# EAGLE design terminator-sil (EAGLE 6.6.0)
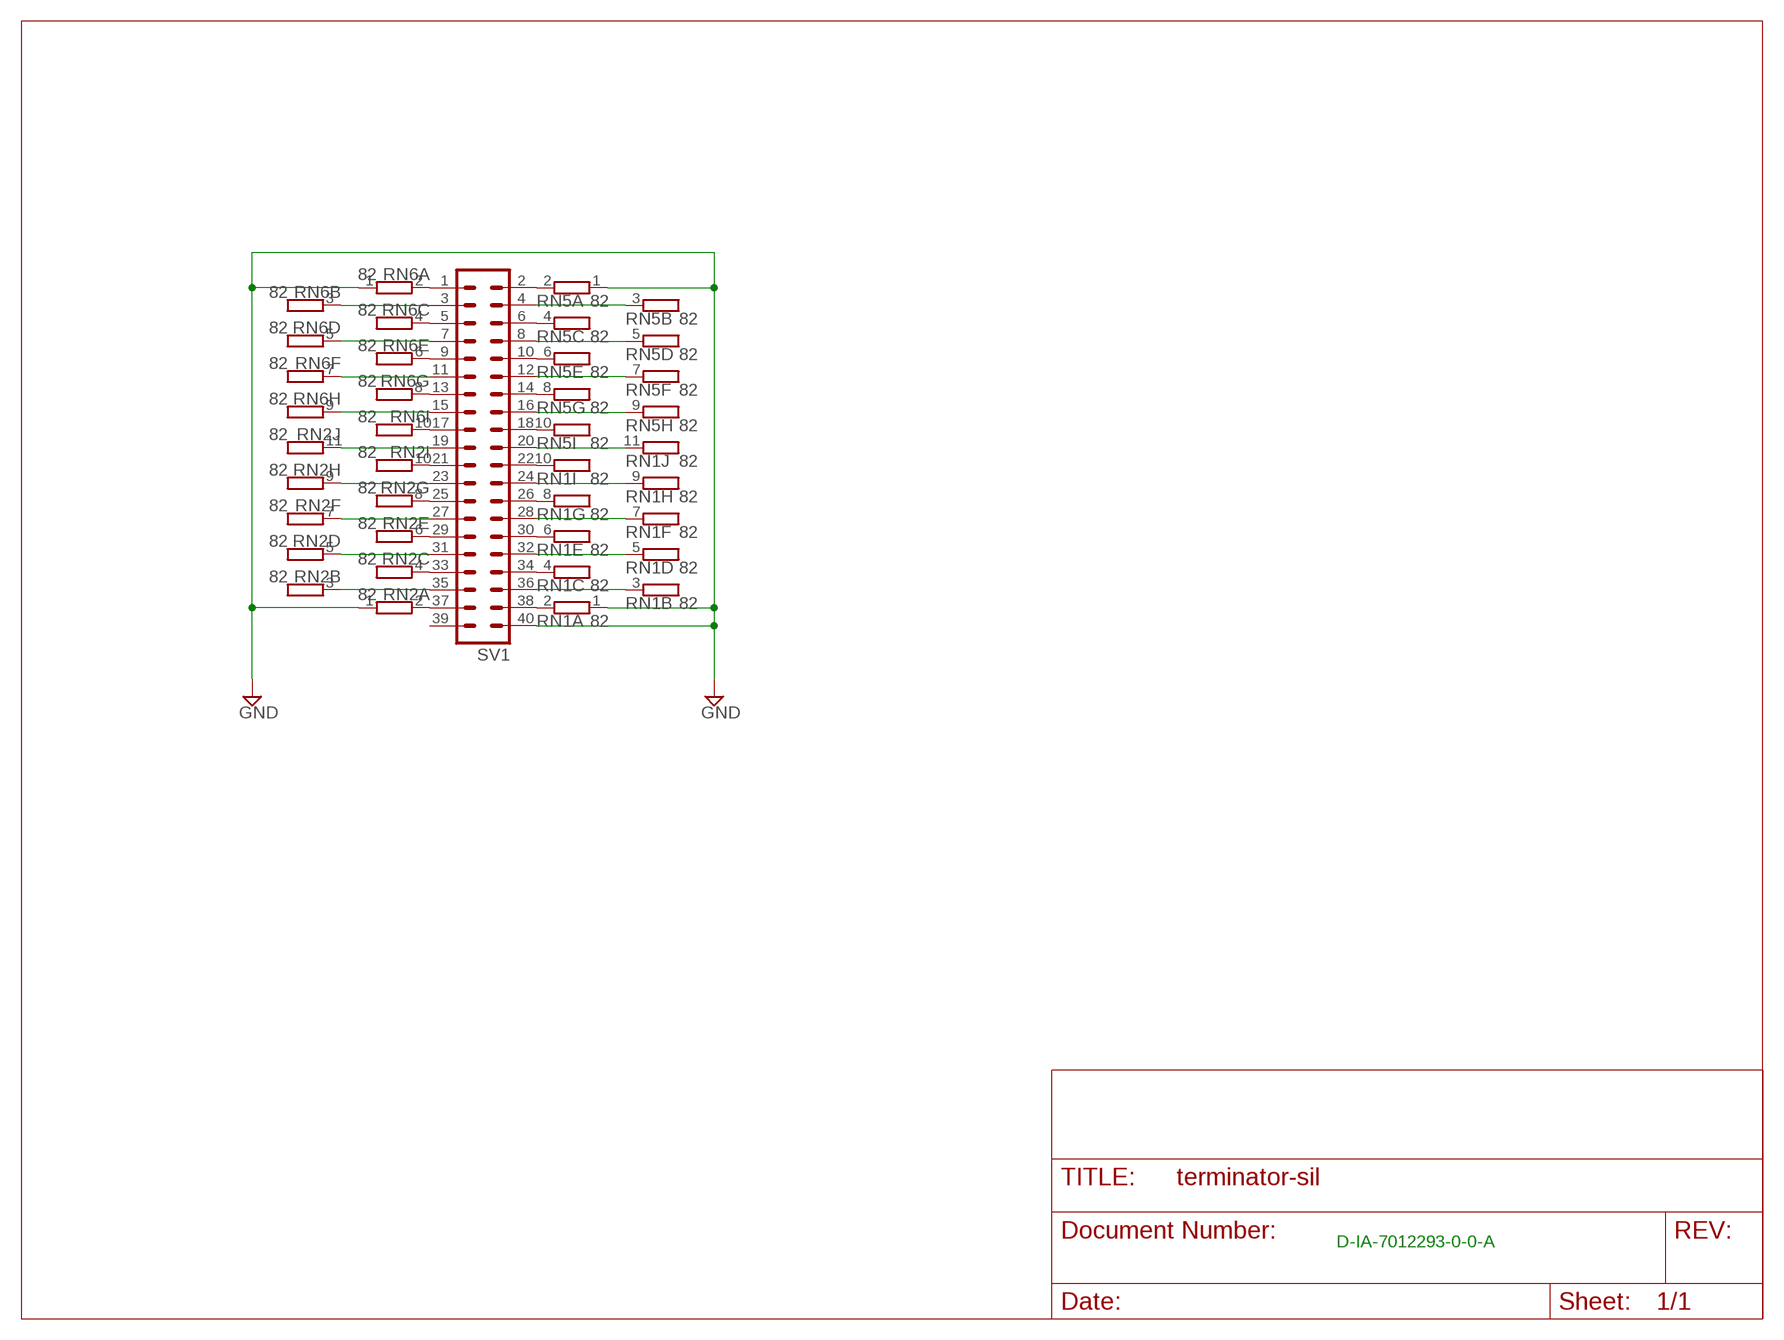
[diagram p0: schematic, sheet 1]

## Parts
RN1  82  GE10R  [SIL11]
RN2  82  GE10R  [SIL11]
RN5  82  GE09R  [SIL10]
RN6  82  GE09R  [SIL10]
SV1  MA20-2  [MA20-2]

## Nets
GND: RN1.1 RN2.1 RN5.1 RN6.1 SV1.40
N$1: RN1.2 SV1.38
N$2: RN1.3 SV1.36
N$3: RN1.4 SV1.34
N$4: RN1.6 SV1.30
N$5: RN1.8 SV1.26
N$6: RN1.10 SV1.22
N$7: RN5.10 SV1.18
N$8: RN5.8 SV1.14
N$9: RN5.6 SV1.10
N$10: RN5.4 SV1.6
N$11: RN5.3 SV1.4
N$12: RN1.5 SV1.32
N$13: RN1.7 SV1.28
N$14: RN1.9 SV1.24
N$15: RN1.11 SV1.20
N$16: RN5.9 SV1.16
N$17: RN5.7 SV1.12
N$18: RN5.5 SV1.8
N$19: RN5.2 SV1.2
N$20: RN2.2 SV1.37
N$21: RN2.4 SV1.33
N$22: RN2.6 SV1.29
N$23: RN2.8 SV1.25
N$24: RN2.10 SV1.21
N$25: RN6.10 SV1.17
N$26: RN6.8 SV1.13
N$27: RN6.6 SV1.9
N$28: RN6.4 SV1.5
N$29: RN6.2 SV1.1
N$31: RN6.3 SV1.3
N$32: RN6.5 SV1.7
N$33: RN6.7 SV1.11
N$34: RN6.9 SV1.15
N$35: RN2.3 SV1.35
N$36: RN2.5 SV1.31
N$37: RN2.7 SV1.27
N$38: RN2.9 SV1.23
N$39: RN2.11 SV1.19
Unconnected: SV1.39

## Notes on the sheet
- D-IA-7012293-0-0-A

## Library data of the parts
RN1 RN2 = resistor-sil:GE10R: SIL RESISTOR; OC_FARNELL: unknown; OC_NEWARK: unknown
RN5 RN6 = resistor-sil:GE09R: SIL RESISTOR; OC_FARNELL: unknown; OC_NEWARK: unknown
SV1 = con-lstb:MA20-2: PIN HEADER; OC_FARNELL: unknown; OC_NEWARK: unknown

## Board
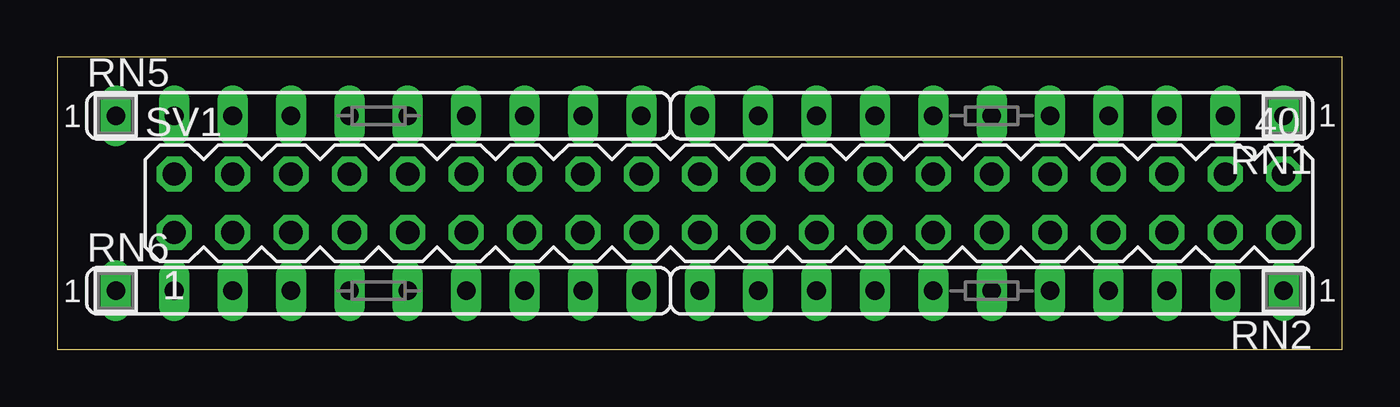
[diagram p1: board, top side]
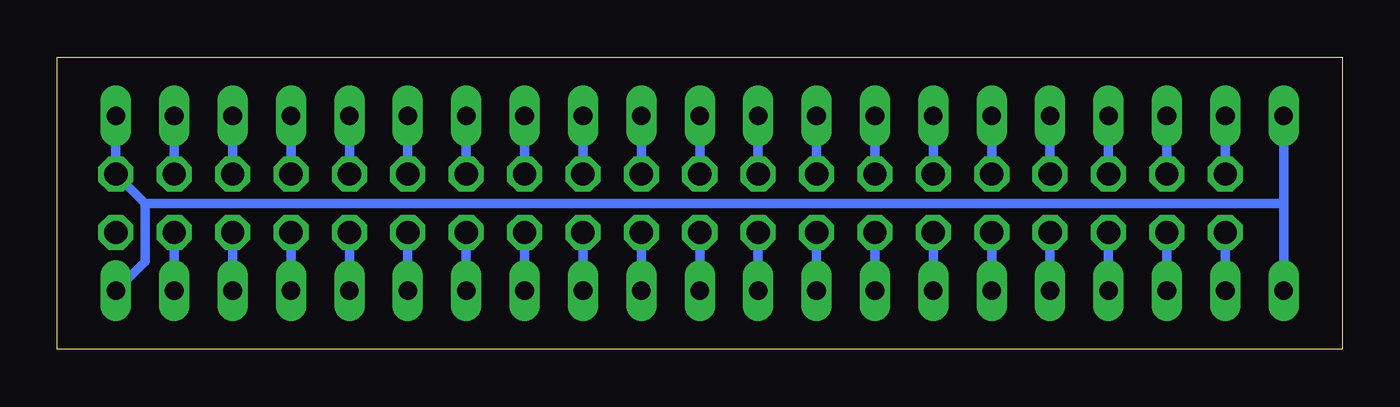
[diagram p2: board, bottom side, seen from below]

Size 55.88 x 12.7 mm. Coordinates in mm from the lower left corner, seen from the top.
Outline: 0,0 55.88,0 55.88,12.7 0,12.7 0,0
Copper layers (1+16): Top 0.035mm / dielectric 1.5mm / Bottom 0.035mm
Design rules "16mils": minimum track width 16mil, minimum drill 32mil, track to track 15mil, track to pad 10mil, pad to pad 10mil, via to via 10mil, smd to smd 10mil, copper to edge 13mil, drill to drill 10mil, minimum pad ring 10mil, minimum via ring 8mil, stop-mask expansion 0mil, vias tented up to drill 0mil, thermal gap 10mil

### Footprints (pad centres in the part's own frame; a part is rotated, then mirrored left to right if it is on the bottom)
SIL11 = drill 0.813 long: 1 -12.7,0; 2 -10.16,0; 3 -7.62,0; 4 -5.08,0; 5 -2.54,0; 6 0,0; 7 2.54,0; 8 5.08,0; 9 7.62,0; 10 10.16,0; 11 12.7,0
SIL10 = drill 0.813 long: 1 -11.43,0; 2 -8.89,0; 3 -6.35,0; 4 -3.81,0; 5 -1.27,0; 6 1.27,0; 7 3.81,0; 8 6.35,0; 9 8.89,0; 10 11.43,0
MA20-2 = drill 1.016 octagon: 1 -24.13,-1.27; 2 -24.13,1.27; 3 -21.59,-1.27; 4 -21.59,1.27; 5 -19.05,-1.27; 6 -19.05,1.27; 7 -16.51,-1.27; 8 -16.51,1.27; 9 -13.97,-1.27; 10 -13.97,1.27; 11 -11.43,-1.27; 12 -11.43,1.27; 13 -8.89,-1.27; 14 -8.89,1.27; 15 -6.35,-1.27; 16 -6.35,1.27; 17 -3.81,-1.27; 18 -3.81,1.27; 19 -1.27,-1.27; 20 -1.27,1.27; 21 1.27,-1.27; 22 1.27,1.27; 23 3.81,-1.27; 24 3.81,1.27; 25 6.35,-1.27; 26 6.35,1.27; 27 8.89,-1.27; 28 8.89,1.27; 29 11.43,-1.27; 30 11.43,1.27; 31 13.97,-1.27; 32 13.97,1.27; 33 16.51,-1.27; 34 16.51,1.27; 35 19.05,-1.27; 36 19.05,1.27; 37 21.59,-1.27; 38 21.59,1.27; 39 24.13,-1.27; 40 24.13,1.27

### Placement (x,y rotation side)
RN1  40.64,10.16 180 top
RN2  40.64,2.54 180 top
RN5  13.97,10.16 0 top
RN6  13.97,2.54 0 top
SV1  29.21,6.35 0 top

### Tracks (layer width: path | path; a pad name or v marks a point on that pad's centre or on a via)
GND
  Bottom 0.406: 2.54,3.81 2.54,6.35 | 2.54,6.35 2.54,8.89 RN5.1 | RN6.1 2.54,3.81 | 52.07,6.35 52.07,3.81 RN2.1 | 52.07,6.35 SV1.40 53.34,8.89 RN1.1 | 2.54,6.35 52.07,6.35 | RN6.1 2.54,3.81 | RN6.1 2.54,3.81
N$1
  Bottom 0.406: SV1.38 50.8,8.89 RN1.2
N$2
  Bottom 0.406: SV1.36 48.26,8.89 RN1.3
N$3
  Bottom 0.406: SV1.34 45.72,8.89 RN1.4
N$4
  Bottom 0.406: SV1.30 40.64,8.89 RN1.6
N$5
  Bottom 0.406: SV1.26 35.56,8.89 RN1.8
N$6
  Bottom 0.406: SV1.22 30.48,8.89 RN1.10
N$7
  Bottom 0.406: SV1.18 25.4,8.89 RN5.10
N$8
  Bottom 0.406: SV1.14 20.32,8.89 RN5.8
N$9
  Bottom 0.406: SV1.10 15.24,8.89 RN5.6
N$10
  Bottom 0.406: SV1.6 10.16,8.89 RN5.4
N$11
  Bottom 0.406: SV1.4 7.62,8.89 RN5.3
N$12
  Bottom 0.406: SV1.32 43.18,8.89 RN1.5
N$13
  Bottom 0.406: SV1.28 38.1,8.89 RN1.7
N$14
  Bottom 0.406: SV1.24 33.02,8.89 RN1.9
N$15
  Bottom 0.406: SV1.20 27.94,8.89 RN1.11
N$16
  Bottom 0.406: SV1.16 22.86,8.89 RN5.9
N$17
  Bottom 0.406: SV1.12 17.78,8.89 RN5.7
N$18
  Bottom 0.406: SV1.8 12.7,8.89 RN5.5
N$19
  Bottom 0.406: SV1.2 5.08,8.89 RN5.2
N$20
  Bottom 0.406: SV1.37 50.8,3.81 RN2.2
N$21
  Bottom 0.406: SV1.33 45.72,3.81 RN2.4
N$22
  Bottom 0.406: SV1.29 40.64,3.81 RN2.6
N$23
  Bottom 0.406: SV1.25 35.56,3.81 RN2.8
N$24
  Bottom 0.406: SV1.21 30.48,3.81 RN2.10
N$25
  Bottom 0.406: SV1.17 25.4,3.81 RN6.10
N$26
  Bottom 0.406: SV1.13 20.32,3.81 RN6.8
N$27
  Bottom 0.406: SV1.9 15.24,3.81 RN6.6
N$28
  Bottom 0.406: SV1.5 10.16,3.81 RN6.4
N$29
  Bottom 0.406: SV1.1 5.08,3.81 RN6.2
N$31
  Bottom 0.406: SV1.3 7.62,3.81 RN6.3
N$32
  Bottom 0.406: SV1.7 12.7,3.81 RN6.5
N$33
  Bottom 0.406: SV1.11 17.78,3.81 RN6.7
N$34
  Bottom 0.406: SV1.15 22.86,3.81 RN6.9
N$35
  Bottom 0.406: SV1.35 48.26,3.81 RN2.3
N$36
  Bottom 0.406: SV1.31 43.18,3.81 RN2.5
N$37
  Bottom 0.406: SV1.27 38.1,3.81 RN2.7
N$38
  Bottom 0.406: SV1.23 33.02,3.81 RN2.9
N$39
  Bottom 0.406: SV1.19 27.94,3.81 RN2.11